# Altium project FMC_ADC_250M_16B_4ch.PrjPCB (part 4 of 4)

## Sheet Triggers.SchDoc
size A4
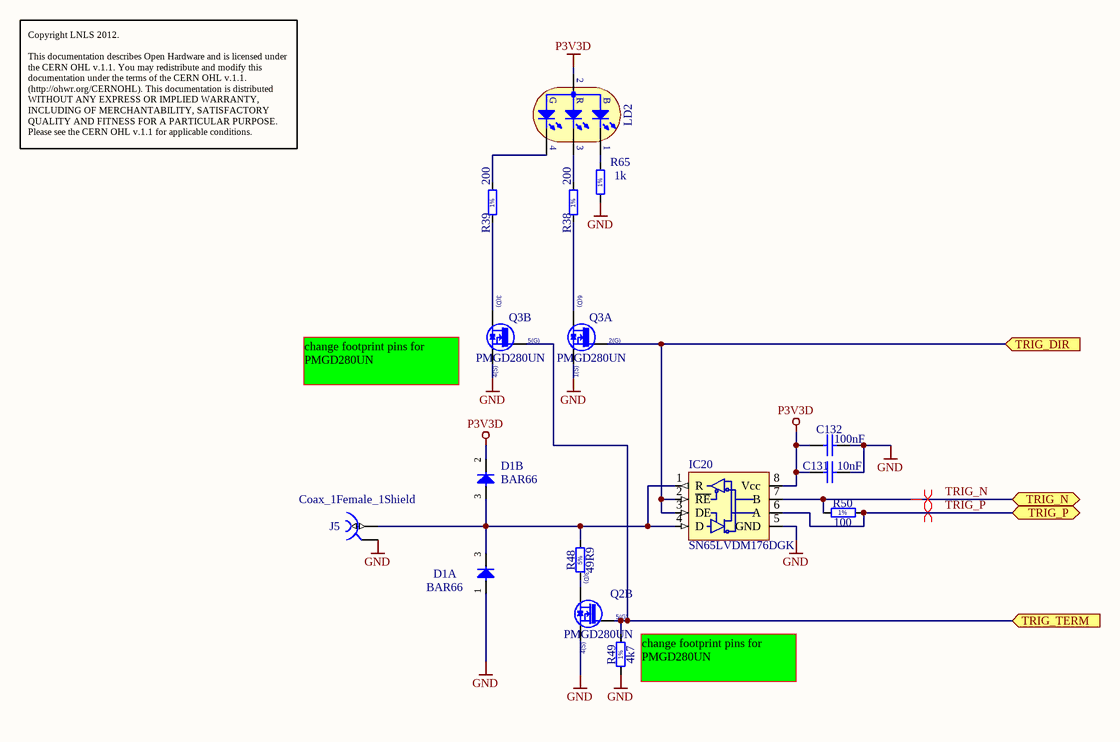
[diagram p7: Triggers.SchDoc]

### Parts
C131  10nF  [CAPC0603X33N]
C132  100nF  [CAPC0603X33N]
D1  BAR66  [SOT95P240X110-3I]  (parts A,B of 2)
IC20  SN65LVDM176DGK  [SOP65P490X110-8N]
J5  Coax_1Female_1Shield  [HUBER-SUHNER_85_MMCX-50-0-1/111 OH]
LD2  (no value)  [LED_AVAGO_HSMF-C113]
Q2  PMGD280UN  [SOT65P210X110-6N]  (part B of 2)
Q3  PMGD280UN  [SOT65P210X110-6N]  (parts A,B of 2)
R38  200  [RESC1005X40N]
R39  200  [RESC1005X40N]
R48  49R9  [RESC3225X70N]
R49  4k7  [RESC1005X40N]
R50  100  [RESC1005X40N]
R65  1k  [RESC1005X40N]

### Ports
TRIG_DIR (in), TRIG_N (bidir), TRIG_P (bidir), TRIG_TERM (in)

### Nets
GND: C131.2 C132.2 D1.1(A) IC20.5(GND) J5.2 Q2.4(S) Q3.1(S) Q3.4(S) R49.1 R65.1
P3V3D: C131.1 C132.1 D1.2(C) IC20.8(Vcc) LD2.2(AC)
TRIG_DIR: IC20.2(~{RE}) IC20.3(DE) Q3.2(G) ; port TRIG_DIR
TRIG_N: IC20.7(B) R50.1 ; port TRIG_N  [project net LA33_N]
TRIG_P: IC20.6(A) R50.2 ; port TRIG_P  [project net LA33_P]
TRIG_TERM: Q2.5(G) Q3.5(G) R49.2 ; port TRIG_TERM
NetD1_3: D1.3(COMAC) IC20.1(R) IC20.4(D) J5.1 R48.2
NetLD2_1: LD2.1(CB) R65.2
NetLD2_3: LD2.3(CR) R38.2
NetLD2_4: LD2.4(CG) R39.2
NetQ2_3: Q2.3(D) R48.1
NetQ3_3: Q3.3(D) R39.1
NetQ3_6: Q3.6(D) R38.1

### Layout directives
differential pair: LA33_N, LA33_P

### Notes on the sheet
- Copyright LNLS 2012.
  This documentation describes Open Hardware and is licensed under the CERN OHL v.1.1. You may redistribute and modify this documentation under the terms of the CERN OHL v.1.1. (http://ohwr.org/CERNOHL). This documentation is distributed WITHOUT ANY EXPRESS OR IMPLIED WARRANTY, INCLUDING OF MERCHANTABILITY, SATISFACTORY QUALITY AND FITNESS FOR A PARTICULAR PURPOSE. Please see the CERN OHL v.1.1 for applicable conditions.
- (near Q3) change footprint pins for PMGD280UN
- (near R49) change footprint pins for PMGD280UN
- (in symbol LED_AVAGO_HSMF-C113) G; R; B
- (in symbol PMGD280UN, part A) 6(D); 2(G); 1(S)
- (in symbol PMGD280UN, part B) 3(D); 5(G); 4(S)
- (in symbol R0402_1K_1%_0.0625W_100PPM) 1%
- (in symbol R0402_4K7_1%_0.0625W_100PPM) 1%
- (in symbol R0402_100R_1%_0.0625W_100PPM) 1%
- (in symbol R0402_200R_1%_0.0625W_100PPM) 1%
- (in symbol R1210_270R_5%_0.5W_200PPM) 5%

### Library data of the parts
C131 = CC0201_10NF_10V_10%_X5R: Non-polarised capacitor; Part Description: SMD Multilayer Chip Ceramic Capacitor; Manufacturer: GENERIC; Manufacturer1 Part Number: 0201ZD103KAT2A; Voltage: 10V; TC: X5R; Tolerance: ±10%; Table: Capacitors SMD; Part Number: CC0201_10NF_10V_10%_X5R; Component Kind: Standard; Component Type: Standard; Pin Count: 2; Value: 10nF; Status: Not Recommended; Manufacturer Part Number: CC0201_10NF_10V_10%_X5R; Case: 0201; Mounted: Yes; Socket: No; SMD: Yes; Manufacturer1 Example: AVX; Manufacturer1 ComponentHeight: 0.33mm; HelpURL: \\cern.ch\dfs\Applications\Altium\Datasheets\CC0201_X5R_AVX.pdf; Author: CERN DEM JLC; CreateDate: 03/12/2007; LatestRevisionDate: 03/12/2007; Sense: No
C132 = CC0201_100NF_6.3V_10%_X5R: Non-polarised capacitor; Part Description: SMD Multilayer Chip Ceramic Capacitor; Manufacturer: GENERIC; Manufacturer1 Part Number: 02016D104KAT2A; Voltage: 6.3V; TC: X5R; Tolerance: ±10%; Table: Capacitors SMD; Part Number: CC0201_100NF_6.3V_10%_X5R; Component Kind: Standard; Component Type: Standard; Pin Count: 2; Value: 100nF; Status: Not Recommended; Manufacturer Part Number: CC0201_100NF_6.3V_10%_X5R; Case: 0201; Mounted: Yes; Socket: No; SMD: Yes; Manufacturer1 Example: AVX; Manufacturer1 ComponentHeight: 0.33mm; HelpURL: \\cern.ch\dfs\Applications\Altium\Datasheets\CC0201_X5R_AVX.pdf; Author: CERN DEM JLC; CreateDate: 03/12/2007; LatestRevisionDate: 03/12/2007; Sense: No
D1 = Diode x2 A1C3_A3C2: Serial Diode; Part Description: Silicon PIN Diode Array (Series Connected); Manufacturer: INFINEON; Voltage: 150V; Power: 250mA; Table: Diodes; Part Number: BAR66; Component Kind: Standard; Component Type: Standard; Device: BAR66; Footprint: SOT95P240X110-3N; PackageDescription: SOT23 3-Leads, Pitch 0.95mm - Body 1.3x2.9mm, IPC Medium Density; Manufacturer Part Number: BAR66; Pin Count: 3; Mounted: Yes; Socket: No; SMD: Yes; ComponentHeight: 1.1mm; HelpURL: C:\TSR\Laurin\Projects\FMC\CERN DAC\Parts\Digital\BAR66.pdf; Author: CERN DEM JLC; CreateDate: 18/01/2010; LatestRevisionDate: 05/10/2010; Case: SOT23
IC20 = SN65LVDM176DGK: Differential Bus Transceiver; Part Description: High Speed Differential Transceiver LVDS/LVTTL; Manufacturer: TEXAS INSTRUMENTS; PressFit: No; Bonding: No; Part Number: SN65LVDM176DGK; Component Kind: Standard; Component Type: Standard; Device: SN65LVDM176DGK; PackageDescription: SOP, 0.65mm pitch; 8 pin, 3.00mm W X 3.00mm L X 1.10mm H body, IPC Medium Density; Manufacturer Part Number: SN65LVDM176DGK; Pin Count: 8; Case: SOP8; Mounted: Yes; Socket: No; SMD: Yes; Sense: No; ComponentHeight: 1.1mm; Author: LNLS DIG GBMB; CreateDate: 28/05/2016; LatestRevisionDate: 28/05/2016
J5 = HUBER-SUHNER_85_MMCX-50-0-1/111 OH: Part Description: MMCX 50 Ohms Right Angle PCB Jack; Manufacturer: HUBER+SUHNER; Table: Miscellaneous; Part Number: HUBER-SUHNER_85_MMCX-50-0-1/111 OH; Component Kind: Standard; Component Type: Standard; Pin Count: 2; Family: MMCX; Mounted: Yes; Socket: No; SMD: No; Status: None; Manufacturer Part Number: 85_MMCX-50-0-1/111 OH; ComponentHeight: 9.6mm; HelpURL: \\cern.ch\dfs\Applications\Altium\Datasheets\HUBER-SUHNER_85_MMCX-50-0-1-111 OH.pdf; Author: CERN DEM JLC; CreateDate: 2011-10-04; LatestRevisionDate: 2011-10-04
LD2 = LED_AVAGO_HSMF-C113: Tricolor LEDs 1 Cathode Blue, 2 Common Anode, 3 Cathode Red, 4 Cathode Green; Part Description: Right Angle Tricolor (Blue, Red, Green) Surface Mount ChipLED; Manufacturer: AVAGO TECHNOLOGIES; Color: Blue/Red/Green; Table: LEDs & Displays; Bonding: No; PressFit: No; Part Number: LED_AVAGO_HSMF-C113; Component Kind: Standard; Component Type: Standard; PackageDescription: Right Angle Tricolor Surface Mount ChipLED, Body 2.5x1mm; Manufacturer Part Number: HSMF-C113; Pin Count: 4; Mounted: Yes; Socket: No; SMD: Yes; ComponentHeight: 1mm; HelpURL: \\cern.ch\dfs\Applications\Altium\Datasheets\LED_AVAGO_HSMF-C113.pdf; Author: CERN DEM JLC; CreateDate: 29/09/2010; LatestRevisionDate: 29/09/2010; Sense: No
Q2 Q3 = PMGD280UN: Dual N-Channel micro TrenchMOS™ Ultra Low Level FET; Manufacturer: NXP SEMICONDUCTORS; Part Description: 20V 870mA Dual N-Channel micro TrenchMOS™ Ultra Low Level FET; Bonding: No; PressFit: No; Part Number: PMGD280UN; Author: CERN DEM JLC; Case: SOT363; ComponentHeight: 1.1mm; Component Type: Standard; CreateDate: 19/11/2014; Device: PMGD280UN; HelpURL: \\cern.ch\dfs\Applications\Altium\Datasheets\PMGD280UN.pdf; LatestRevisionDate: 19/11/2014; Manufacturer Part Number: PMGD280UN; Mounted: Yes; PackageDescription: SOT363, SC70-6, SOT, 0.65mm Pitch, 6 pin, 1.25mm W X 2.00mm L X 1.10mm H, IPC Medium Density; Pin Count: 6; Sense: No; SMD: Yes; Socket: No
R38 R39 = R0402_200R_1%_0.0625W_100PPM: Resistor - 1%; Part Description: General Purpose Thick Film Chip Resistor; Manufacturer: GENERIC; Manufacturer1 Part Number: 232270672001L; TC: ±100ppm/°C; Table: Resistors SMD; Part Number: R0402_200R_1%_0.0625W_100PPM; Component Kind: Standard; Component Type: Standard; Pin Count: 2; Value: 200; Status: Not recommended; Power: 0.0625W; Tolerance: ±1%; Manufacturer Part Number: R0402_200R_1%_0.0625W_100PPM; Case: 0402; Mounted: Yes; Socket: No; SMD: Yes; Manufacturer1 Example: YAGEO PHYCOMP; Manufacturer1 ComponentHeight: 0.4mm; HelpURL: \\cern.ch\dfs\Applications\Altium\Datasheets\R0402_Phycomp_RC0402.pdf; Author: CERN DEM JLC; CreateDate: 03/12/2007; LatestRevisionDate: 17/10/2012; Sense: No
R48 = R1210_270R_5%_0.5W_200PPM: Resistor - 5%; Part Number: R1210_49R9_1%_0.33W_100PPM; Part Description: General Purpose Thick Film Chip Resistor; Manufacturer: VISHAY; Manufacturer Part Number: CRCW121049R9FK; Power: 0.33W; TC: ±100ppm/°C; Table: Resistors SMD; Component Kind: Standard; Component Type: Standard; Pin Count: 2; Value: 49R9; Status: None; Tolerance: ±5%; Case: 1210; Mounted: Yes; Socket: No; SMD: Yes; ComponentHeight: 0.7mm; HelpURL: \\cern.ch\dfs\Applications\Altium\Datasheets\R1210_PANASONIC_ERJ.pdf; Author: CERN DEM JLC; CreateDate: 2011-10-26; LatestRevisionDate: 2011-10-26
R49 = R0402_4K7_1%_0.0625W_100PPM: Resistor - 1%; Part Description: General Purpose Thick Film Chip Resistor; Manufacturer: GENERIC; Manufacturer1 Part Number: 232270674702L; TC: ±100ppm/°C; Table: Resistors SMD; Part Number: R0402_4K7_1%_0.0625W_100PPM; Component Kind: Standard; Component Type: Standard; Pin Count: 2; Value: 4k7; Status: Not recommended; Power: 0.0625W; Tolerance: ±1%; Manufacturer Part Number: R0402_4K7_1%_0.0625W_100PPM; Case: 0402; Mounted: Yes; Socket: No; SMD: Yes; Manufacturer1 Example: YAGEO PHYCOMP; Manufacturer1 ComponentHeight: 0.4mm; HelpURL: \\cern.ch\dfs\Applications\Altium\Datasheets\R0402_Phycomp_RC0402.pdf; Author: CERN DEM JLC; CreateDate: 03/12/2007; LatestRevisionDate: 17/10/2012; Sense: No
R50 = R0402_100R_1%_0.0625W_100PPM: as R51-R53 on sheet Clock_Distribution; Part Number: R0402_100R_1%_0.0625W_100PPM; Component Kind: Standard; Component Type: Standard; Pin Count: 2; Value: 100; Status: Not recommended; Power: 0.0625W; Tolerance: ±1%; Manufacturer Part Number: R0402_100R_1%_0.0625W_100PPM; Case: 0402; Mounted: Yes; Socket: No; SMD: Yes; Manufacturer1 Example: YAGEO PHYCOMP; Manufacturer1 ComponentHeight: 0.4mm; HelpURL: \\cern.ch\dfs\Applications\Altium\Datasheets\R0402_Phycomp_RC0402.pdf; Author: CERN DEM JLC; CreateDate: 03/12/2007; LatestRevisionDate: 17/10/2012; Sense: No
R65 = R0402_1K_1%_0.0625W_100PPM: Resistor - 1%; Part Description: General Purpose Thick Film Chip Resistor; Manufacturer: GENERIC; Manufacturer1 Part Number: 232270671002L; TC: ±100ppm/°C; Table: Resistors SMD; Part Number: R0402_1K_1%_0.0625W_100PPM; Component Kind: Standard; Component Type: Standard; Pin Count: 2; Value: 1k; Status: Not recommended; Power: 0.0625W; Tolerance: ±1%; Manufacturer Part Number: R0402_1K_1%_0.0625W_100PPM; Case: 0402; Mounted: Yes; Socket: No; SMD: Yes; Manufacturer1 Example: YAGEO PHYCOMP; Manufacturer1 ComponentHeight: 0.4mm; HelpURL: \\cern.ch\dfs\Applications\Altium\Datasheets\R0402_Phycomp_RC0402.pdf; Author: CERN DEM JLC; CreateDate: 03/12/2007; LatestRevisionDate: 17/10/2012; Sense: No

## Nets that join several sheets
3P3VAUX: EEPROM_Temp_LEDs (C55.2 IC22.8), FMC_connector (J6.d32)
GND: FMC_ADC_top (21 pins), EEPROM_Temp_LEDs (14 pins), FMC_connector (162 pins), U_ADC (30 pins), Supply (59 pins), Clock_Distribution (59 pins), U_ADC (30 pins), U_ADC (30 pins), U_ADC (30 pins), ADC_Buffers (99 pins), Triggers (10 pins)
P1V8_AVDD1: U_ADC (L4A.1), Supply (6 pins), U_ADC (L4B.1)
P1V8_AVDD2: Supply (6 pins), U_ADC (L4C.1), U_ADC (L4D.1)
P1V8_OVDD: FMC_ADC_top (C25.1 C129.2 IC18.1 IC19.1), U_ADC (L5A.2), Supply (6 pins), U_ADC (L5B.2), U_ADC (L5C.2), U_ADC (L5D.2)
P3V3: FMC_connector (J6.c39 J6.d36 J6.d38 J6.d40), Supply (C36.1 L2.1 L6.1 L8.1)
P3V3_BUF: Supply (C76.1 C123.1 L2.2), ADC_Buffers (126 pins)
P3V3CLK: Supply (C127.2 IC17.1 IC17.3 IC17.20), Clock_Distribution (45 pins)
P3V3D: EEPROM_Temp_LEDs (7 pins), FMC_connector (R132.1), Supply (C77.1 L6.2), Triggers (5 pins)
P12V0: FMC_connector (J6.c35 J6.c37), Supply (6 pins)
VADJ: FMC_ADC_top (6 pins), FMC_connector (8 pins), Clock_Distribution (IC26.2)
ADC1_CLK_N: U_ADC (C19A.1), Clock_Distribution (IC2.34 R20.1)
ADC1_CLK_P: U_ADC (C8A.1), Clock_Distribution (IC2.35 R19.1)
ADC2_CLK_N: Clock_Distribution (IC2.28 R23.1), U_ADC (C19B.1)
ADC2_CLK_P: Clock_Distribution (IC2.29 R21.1), U_ADC (C8B.1)
ADC3_CLK_N: Clock_Distribution (IC2.53 R18.1), U_ADC (C19C.1)
ADC3_CLK_P: Clock_Distribution (IC2.54 R17.1), U_ADC (C8C.1)
ADC4_CLK_N: Clock_Distribution (IC2.57 R15.1), U_ADC (C19D.1)
ADC4_CLK_P: Clock_Distribution (IC2.58 R14.1), U_ADC (C8D.1)
ADC_BUF_CSB0: FMC_ADC_top (IC18.5), U_ADC (IC1A.67)
ADC_BUF_CSB1: FMC_ADC_top (IC18.6), U_ADC (IC1B.67)
ADC_BUF_CSB2: FMC_ADC_top (IC18.7), U_ADC (IC1C.67)
ADC_BUF_CSB3: FMC_ADC_top (IC18.8), U_ADC (IC1D.67)
ADC_BUF_DATA0.CLKOUT_N: FMC_connector (J6.f5), ADC_Buffers (IC5.31)
ADC_BUF_DATA0.CLKOUT_P: FMC_connector (J6.f4), ADC_Buffers (IC5.32)
ADC_BUF_DATA0.D0_N: FMC_connector (J6.e3), ADC_Buffers (IC6.26)
ADC_BUF_DATA0.D0_P: FMC_connector (J6.e2), ADC_Buffers (IC6.25)
ADC_BUF_DATA0.D2_N: FMC_connector (J6.f8), ADC_Buffers (IC6.29)
ADC_BUF_DATA0.D2_P: FMC_connector (J6.f7), ADC_Buffers (IC6.30)
ADC_BUF_DATA0.D4_N: FMC_connector (J6.e7), ADC_Buffers (IC6.27)
ADC_BUF_DATA0.D4_P: FMC_connector (J6.e6), ADC_Buffers (IC6.28)
ADC_BUF_DATA0.D6_N: FMC_connector (J6.e10), ADC_Buffers (IC6.32)
ADC_BUF_DATA0.D6_P: FMC_connector (J6.e9), ADC_Buffers (IC6.31)
ADC_BUF_DATA0.D8_N: FMC_connector (J6.j7), ADC_Buffers (IC5.29)
ADC_BUF_DATA0.D8_P: FMC_connector (J6.j6), ADC_Buffers (IC5.30)
ADC_BUF_DATA0.D10_N: FMC_connector (J6.k8), ADC_Buffers (IC5.27)
ADC_BUF_DATA0.D10_P: FMC_connector (J6.k7), ADC_Buffers (IC5.28)
ADC_BUF_DATA0.D12_N: FMC_connector (J6.j10), ADC_Buffers (IC5.25)
ADC_BUF_DATA0.D12_P: FMC_connector (J6.j9), ADC_Buffers (IC5.26)
ADC_BUF_DATA0.D14_N: FMC_connector (J6.k11), ADC_Buffers (IC7.26)
ADC_BUF_DATA0.D14_P: FMC_connector (J6.k10), ADC_Buffers (IC7.25)
ADC_BUF_DATA1.CLKOUT_N: FMC_connector (J6.d9), ADC_Buffers (IC8.29)
ADC_BUF_DATA1.CLKOUT_P: FMC_connector (J6.d8), ADC_Buffers (IC8.30)
ADC_BUF_DATA1.D0_N: FMC_connector (J6.h11), ADC_Buffers (IC7.28)
ADC_BUF_DATA1.D0_P: FMC_connector (J6.h10), ADC_Buffers (IC7.27)
ADC_BUF_DATA1.D2_N: FMC_connector (J6.g10), ADC_Buffers (IC7.30)
ADC_BUF_DATA1.D2_P: FMC_connector (J6.g9), ADC_Buffers (IC7.29)
ADC_BUF_DATA1.D4_N: FMC_connector (J6.g13), ADC_Buffers (IC7.32)
ADC_BUF_DATA1.D4_P: FMC_connector (J6.g12), ADC_Buffers (IC7.31)
ADC_BUF_DATA1.D6_N: FMC_connector (J6.h14), ADC_Buffers (IC8.31)
ADC_BUF_DATA1.D6_P: FMC_connector (J6.h13), ADC_Buffers (IC8.32)
ADC_BUF_DATA1.D8_N: FMC_connector (J6.g16), ADC_Buffers (IC8.27)
ADC_BUF_DATA1.D8_P: FMC_connector (J6.g15), ADC_Buffers (IC8.28)
ADC_BUF_DATA1.D10_N: FMC_connector (J6.d18), ADC_Buffers (IC8.25)
ADC_BUF_DATA1.D10_P: FMC_connector (J6.d17), ADC_Buffers (IC8.26)
ADC_BUF_DATA1.D12_N: FMC_connector (J6.h17), ADC_Buffers (IC9.26)
ADC_BUF_DATA1.D12_P: FMC_connector (J6.h16), ADC_Buffers (IC9.25)
ADC_BUF_DATA1.D14_N: FMC_connector (J6.g19), ADC_Buffers (IC9.28)
ADC_BUF_DATA1.D14_P: FMC_connector (J6.g18), ADC_Buffers (IC9.27)
ADC_BUF_DATA2.CLKOUT_N: FMC_connector (J6.c23), ADC_Buffers (IC12.27)
ADC_BUF_DATA2.CLKOUT_P: FMC_connector (J6.c22), ADC_Buffers (IC12.28)
ADC_BUF_DATA2.D0_N: FMC_connector (J6.d21), ADC_Buffers (IC9.30)
ADC_BUF_DATA2.D0_P: FMC_connector (J6.d20), ADC_Buffers (IC9.29)
ADC_BUF_DATA2.D2_N: FMC_connector (J6.g22), ADC_Buffers (IC9.32)
ADC_BUF_DATA2.D2_P: FMC_connector (J6.g21), ADC_Buffers (IC9.31)
ADC_BUF_DATA2.D4_N: FMC_connector (J6.d24), ADC_Buffers (IC12.31)
ADC_BUF_DATA2.D4_P: FMC_connector (J6.d23), ADC_Buffers (IC12.32)
ADC_BUF_DATA2.D6_N: FMC_connector (J6.h23), ADC_Buffers (IC12.29)
ADC_BUF_DATA2.D6_P: FMC_connector (J6.h22), ADC_Buffers (IC12.30)
ADC_BUF_DATA2.D8_N: FMC_connector (J6.g25), ADC_Buffers (IC12.25)
ADC_BUF_DATA2.D8_P: FMC_connector (J6.g24), ADC_Buffers (IC12.26)
ADC_BUF_DATA2.D10_N: FMC_connector (J6.h26), ADC_Buffers (IC10.26)
ADC_BUF_DATA2.D10_P: FMC_connector (J6.h25), ADC_Buffers (IC10.25)
ADC_BUF_DATA2.D12_N: FMC_connector (J6.g28), ADC_Buffers (IC10.30)
ADC_BUF_DATA2.D12_P: FMC_connector (J6.g27), ADC_Buffers (IC10.29)
ADC_BUF_DATA2.D14_N: FMC_connector (J6.d27), ADC_Buffers (IC10.28)
ADC_BUF_DATA2.D14_P: FMC_connector (J6.d26), ADC_Buffers (IC10.27)
ADC_BUF_DATA3.CLKOUT_N: FMC_connector (J6.k29), ADC_Buffers (IC13.25)
ADC_BUF_DATA3.CLKOUT_P: FMC_connector (J6.k28), ADC_Buffers (IC13.26)
ADC_BUF_DATA3.D0_N: FMC_connector (J6.k26), ADC_Buffers (IC10.32)
ADC_BUF_DATA3.D0_P: FMC_connector (J6.k25), ADC_Buffers (IC10.31)
ADC_BUF_DATA3.D2_N: FMC_connector (J6.j31), ADC_Buffers (IC13.31)
ADC_BUF_DATA3.D2_P: FMC_connector (J6.j30), ADC_Buffers (IC13.32)
ADC_BUF_DATA3.D4_N: FMC_connector (J6.f32), ADC_Buffers (IC13.29)
ADC_BUF_DATA3.D4_P: FMC_connector (J6.f31), ADC_Buffers (IC13.30)
ADC_BUF_DATA3.D6_N: FMC_connector (J6.k32), ADC_Buffers (IC13.27)
ADC_BUF_DATA3.D6_P: FMC_connector (J6.k31), ADC_Buffers (IC13.28)
ADC_BUF_DATA3.D8_N: FMC_connector (J6.j34), ADC_Buffers (IC11.26)
ADC_BUF_DATA3.D8_P: FMC_connector (J6.j33), ADC_Buffers (IC11.25)
ADC_BUF_DATA3.D10_N: FMC_connector (J6.k35), ADC_Buffers (IC11.28)
ADC_BUF_DATA3.D10_P: FMC_connector (J6.k34), ADC_Buffers (IC11.27)
ADC_BUF_DATA3.D12_N: FMC_connector (J6.j37), ADC_Buffers (IC11.30)
ADC_BUF_DATA3.D12_P: FMC_connector (J6.j36), ADC_Buffers (IC11.29)
ADC_BUF_DATA3.D14_N: FMC_connector (J6.k38), ADC_Buffers (IC11.32)
ADC_BUF_DATA3.D14_P: FMC_connector (J6.k37), ADC_Buffers (IC11.31)
ADC_BUF_RESETn: FMC_ADC_top (IC18.10), U_ADC (IC1A.18), U_ADC (IC1B.18), U_ADC (IC1C.18), U_ADC (IC1D.18)
ADC_BUF_SCLK: FMC_ADC_top (IC18.4), U_ADC (IC1A.68), U_ADC (IC1B.68), U_ADC (IC1C.68), U_ADC (IC1D.68)
ADC_BUF_SDI: FMC_ADC_top (IC18.3), U_ADC (IC1A.69), U_ADC (IC1B.69), U_ADC (IC1C.69), U_ADC (IC1D.69)
ADC_BUF_SDO: FMC_ADC_top (IC19.3), U_ADC (IC1A.66), U_ADC (IC1B.66), U_ADC (IC1C.66), U_ADC (IC1D.66)
ADC_BUF_SLEEP: FMC_ADC_top (IC18.9), U_ADC (IC1A.3), U_ADC (IC1B.3), U_ADC (IC1C.3), U_ADC (IC1D.3)
ADC_CSB0: FMC_ADC_top (IC18.19), FMC_connector (J6.c15)
ADC_CSB1: FMC_ADC_top (IC18.18), FMC_connector (J6.d15)
ADC_CSB2: FMC_ADC_top (IC18.17), FMC_connector (J6.c14)
ADC_CSB3: FMC_ADC_top (IC18.16), FMC_connector (J6.d14)
ADC_DATA0.CLKOUT_N: U_ADC (IC1A.47), ADC_Buffers (IC5.10)
ADC_DATA0.CLKOUT_P: U_ADC (IC1A.48), ADC_Buffers (IC5.9)
ADC_DATA0.D0_N: U_ADC (IC1A.63), ADC_Buffers (IC6.15)
ADC_DATA0.D0_P: U_ADC (IC1A.64), ADC_Buffers (IC6.16)
ADC_DATA0.D2_N: U_ADC (IC1A.59), ADC_Buffers (IC6.12)
ADC_DATA0.D2_P: U_ADC (IC1A.60), ADC_Buffers (IC6.11)
ADC_DATA0.D4_N: U_ADC (IC1A.55), ADC_Buffers (IC6.14)
ADC_DATA0.D4_P: U_ADC (IC1A.56), ADC_Buffers (IC6.13)
ADC_DATA0.D6_N: U_ADC (IC1A.51), ADC_Buffers (IC6.9)
ADC_DATA0.D6_P: U_ADC (IC1A.52), ADC_Buffers (IC6.10)
ADC_DATA0.D8_N: U_ADC (IC1A.43), ADC_Buffers (IC5.12)
ADC_DATA0.D8_P: U_ADC (IC1A.44), ADC_Buffers (IC5.11)
ADC_DATA0.D10_N: U_ADC (IC1A.39), ADC_Buffers (IC5.14)
ADC_DATA0.D10_P: U_ADC (IC1A.40), ADC_Buffers (IC5.13)
ADC_DATA0.D12_N: U_ADC (IC1A.35), ADC_Buffers (IC5.16)
ADC_DATA0.D12_P: U_ADC (IC1A.36), ADC_Buffers (IC5.15)
ADC_DATA0.D14_N: U_ADC (IC1A.30), ADC_Buffers (IC7.15)
ADC_DATA0.D14_P: U_ADC (IC1A.31), ADC_Buffers (IC7.16)
ADC_DATA1.CLKOUT_N: U_ADC (IC1B.47), ADC_Buffers (IC8.12)
ADC_DATA1.CLKOUT_P: U_ADC (IC1B.48), ADC_Buffers (IC8.11)
ADC_DATA1.D0_N: U_ADC (IC1B.63), ADC_Buffers (IC7.13)
ADC_DATA1.D0_P: U_ADC (IC1B.64), ADC_Buffers (IC7.14)
ADC_DATA1.D2_N: U_ADC (IC1B.59), ADC_Buffers (IC7.11)
ADC_DATA1.D2_P: U_ADC (IC1B.60), ADC_Buffers (IC7.12)
ADC_DATA1.D4_N: U_ADC (IC1B.55), ADC_Buffers (IC7.9)
ADC_DATA1.D4_P: U_ADC (IC1B.56), ADC_Buffers (IC7.10)
ADC_DATA1.D6_N: U_ADC (IC1B.51), ADC_Buffers (IC8.10)
ADC_DATA1.D6_P: U_ADC (IC1B.52), ADC_Buffers (IC8.9)
ADC_DATA1.D8_N: U_ADC (IC1B.43), ADC_Buffers (IC8.14)
ADC_DATA1.D8_P: U_ADC (IC1B.44), ADC_Buffers (IC8.13)
ADC_DATA1.D10_N: U_ADC (IC1B.39), ADC_Buffers (IC8.16)
ADC_DATA1.D10_P: U_ADC (IC1B.40), ADC_Buffers (IC8.15)
ADC_DATA1.D12_N: U_ADC (IC1B.35), ADC_Buffers (IC9.15)
ADC_DATA1.D12_P: U_ADC (IC1B.36), ADC_Buffers (IC9.16)
ADC_DATA1.D14_N: U_ADC (IC1B.30), ADC_Buffers (IC9.13)
ADC_DATA1.D14_P: U_ADC (IC1B.31), ADC_Buffers (IC9.14)
ADC_DATA2.CLKOUT_N: U_ADC (IC1C.47), ADC_Buffers (IC12.14)
ADC_DATA2.CLKOUT_P: U_ADC (IC1C.48), ADC_Buffers (IC12.13)
ADC_DATA2.D0_N: U_ADC (IC1C.63), ADC_Buffers (IC9.11)
ADC_DATA2.D0_P: U_ADC (IC1C.64), ADC_Buffers (IC9.12)
ADC_DATA2.D2_N: U_ADC (IC1C.59), ADC_Buffers (IC9.9)
ADC_DATA2.D2_P: U_ADC (IC1C.60), ADC_Buffers (IC9.10)
ADC_DATA2.D4_N: U_ADC (IC1C.55), ADC_Buffers (IC12.10)
ADC_DATA2.D4_P: U_ADC (IC1C.56), ADC_Buffers (IC12.9)
ADC_DATA2.D6_N: U_ADC (IC1C.51), ADC_Buffers (IC12.12)
ADC_DATA2.D6_P: U_ADC (IC1C.52), ADC_Buffers (IC12.11)
ADC_DATA2.D8_N: U_ADC (IC1C.43), ADC_Buffers (IC12.16)
ADC_DATA2.D8_P: U_ADC (IC1C.44), ADC_Buffers (IC12.15)
ADC_DATA2.D10_N: U_ADC (IC1C.39), ADC_Buffers (IC10.15)
ADC_DATA2.D10_P: U_ADC (IC1C.40), ADC_Buffers (IC10.16)
ADC_DATA2.D12_N: U_ADC (IC1C.35), ADC_Buffers (IC10.11)
ADC_DATA2.D12_P: U_ADC (IC1C.36), ADC_Buffers (IC10.12)
ADC_DATA2.D14_N: U_ADC (IC1C.30), ADC_Buffers (IC10.13)
ADC_DATA2.D14_P: U_ADC (IC1C.31), ADC_Buffers (IC10.14)
ADC_DATA3.CLKOUT_N: U_ADC (IC1D.47), ADC_Buffers (IC13.16)
ADC_DATA3.CLKOUT_P: U_ADC (IC1D.48), ADC_Buffers (IC13.15)
ADC_DATA3.D0_N: U_ADC (IC1D.63), ADC_Buffers (IC10.9)
ADC_DATA3.D0_P: U_ADC (IC1D.64), ADC_Buffers (IC10.10)
ADC_DATA3.D2_N: U_ADC (IC1D.59), ADC_Buffers (IC13.10)
ADC_DATA3.D2_P: U_ADC (IC1D.60), ADC_Buffers (IC13.9)
ADC_DATA3.D4_N: U_ADC (IC1D.55), ADC_Buffers (IC13.12)
ADC_DATA3.D4_P: U_ADC (IC1D.56), ADC_Buffers (IC13.11)
ADC_DATA3.D6_N: U_ADC (IC1D.51), ADC_Buffers (IC13.14)
ADC_DATA3.D6_P: U_ADC (IC1D.52), ADC_Buffers (IC13.13)
ADC_DATA3.D8_N: U_ADC (IC1D.43), ADC_Buffers (IC11.15)
ADC_DATA3.D8_P: U_ADC (IC1D.44), ADC_Buffers (IC11.16)
ADC_DATA3.D10_N: U_ADC (IC1D.39), ADC_Buffers (IC11.13)
ADC_DATA3.D10_P: U_ADC (IC1D.40), ADC_Buffers (IC11.14)
ADC_DATA3.D12_N: U_ADC (IC1D.35), ADC_Buffers (IC11.11)
ADC_DATA3.D12_P: U_ADC (IC1D.36), ADC_Buffers (IC11.12)
ADC_DATA3.D14_N: U_ADC (IC1D.30), ADC_Buffers (IC11.9)
ADC_DATA3.D14_P: U_ADC (IC1D.31), ADC_Buffers (IC11.10)
ADC_RESETn: FMC_ADC_top (IC18.14), FMC_connector (J6.e12)
ADC_SCLK: FMC_ADC_top (IC18.20), FMC_connector (J6.c18)
ADC_SDI: FMC_ADC_top (IC18.21), FMC_connector (J6.c19)
ADC_SDO: FMC_ADC_top (IC19.4), FMC_connector (J6.d12)
ADC_SLEEP: FMC_ADC_top (IC18.15), FMC_connector (J6.f14)
CLK_SEL: FMC_connector (J6.j22), Clock_Distribution (IC4.6 R44.1)
CLKDIVRST_N: FMC_ADC_top (R3.1), FMC_connector (J6.h38), U_ADC (IC1A.25), U_ADC (IC1B.25), U_ADC (IC1C.25), U_ADC (IC1D.25)
CLKDIVRST_P: FMC_ADC_top (R3.2), FMC_connector (J6.h37), U_ADC (IC1A.24), U_ADC (IC1B.24), U_ADC (IC1C.24), U_ADC (IC1D.24)
FMC_CLK_N: FMC_connector (J6.k5), Clock_Distribution (IC4.4 R45.2)
FMC_CLK_P: FMC_connector (J6.k4), Clock_Distribution (IC4.3 R45.1)
FPGA_CLK_N: FMC_connector (J6.h5), Clock_Distribution (IC2.24)
FPGA_CLK_P: FMC_connector (J6.h4), Clock_Distribution (IC2.25)
GA0: EEPROM_Temp_LEDs (IC22.2), FMC_connector (J6.c34)
GA1: EEPROM_Temp_LEDs (IC22.1), FMC_connector (J6.d35)
IN1: FMC_ADC_top (J1.1), U_ADC (C7A.2)
IN2: FMC_ADC_top (J2.1), U_ADC (C7B.2)
IN3: FMC_ADC_top (J8.1), U_ADC (C7C.2)
IN4: FMC_ADC_top (J9.1), U_ADC (C7D.2)
IPTAT1: EEPROM_Temp_LEDs (R32.2), U_ADC (IC1A.16)
IPTAT2: EEPROM_Temp_LEDs (R33.2), U_ADC (IC1B.16)
IPTAT3: EEPROM_Temp_LEDs (R34.2), U_ADC (IC1C.16)
IPTAT4: EEPROM_Temp_LEDs (R35.2), U_ADC (IC1D.16)
LA24_N: EEPROM_Temp_LEDs (Q1.5), FMC_connector (J6.h29)
LA24_P: EEPROM_Temp_LEDs (Q2.2), FMC_connector (J6.h28)
LA28_N: EEPROM_Temp_LEDs (IC15.2), FMC_connector (J6.h32)
LA29_P: EEPROM_Temp_LEDs (Q1.2), FMC_connector (J6.g30)
LA30_N: EEPROM_Temp_LEDs (IC15.35), FMC_connector (J6.h35)
LA30_P: EEPROM_Temp_LEDs (R46.1), FMC_connector (J6.h34)
LA31_N: EEPROM_Temp_LEDs (IC15.33), FMC_connector (J6.g34)
LA31_P: EEPROM_Temp_LEDs (IC15.32), FMC_connector (J6.g33)
LA33_N: FMC_connector (J6.g37), Triggers (IC20.7 R50.1)
LA33_P: FMC_connector (J6.g36), Triggers (IC20.6 R50.2)
NetC55A_1: FMC_ADC_top (J1.2), U_ADC (C55A.1 C56A.2)
NetC55B_1: FMC_ADC_top (J2.2), U_ADC (C55B.1 C56B.2)
NetC55C_1: FMC_ADC_top (J8.2), U_ADC (C55C.1 C56C.2)
NetC55D_1: FMC_ADC_top (J9.2), U_ADC (C55D.1 C56D.2)
PLL_FUNCTION: FMC_connector (J6.j19), Clock_Distribution (IC2.16)
PLL_SCB: FMC_connector (J6.k19), Clock_Distribution (IC2.21)
PLL_SCLK: FMC_connector (J6.j21), Clock_Distribution (IC2.18)
PLL_SDIO: FMC_connector (D4.2 J6.k20), Clock_Distribution (R51.1)
PLL_SDO: FMC_connector (D6.2 J6.k22), Clock_Distribution (R52.1)
PLL_STATUS: FMC_connector (D5.2 J6.j18), Clock_Distribution (R53.1)
SCL: EEPROM_Temp_LEDs (IC22.6), FMC_connector (J6.c30)
SDA: EEPROM_Temp_LEDs (IC22.5), FMC_connector (J6.c31)
Si_OE: FMC_connector (R75.2), Clock_Distribution (OSC2.2)
Si_SCL: FMC_connector (J6.c10), Clock_Distribution (IC26.3)
Si_SDA: FMC_connector (J6.c11), Clock_Distribution (IC26.4)
TRIG_DIR: FMC_connector (J6.c26), Triggers (IC20.2 IC20.3 Q3.2)
TRIG_TERM: FMC_connector (J6.c27), Triggers (Q2.5 Q3.5 R49.2)

## Assembly variants
active clock: not fitted C60 R22 R24 R41 R56 R57 R58 R59 R60 R61
passive clock: not fitted L1 L3 L9 R26 R62 R63 R66 R67 R68 R69 R70 R71 R72 R73; alternate parts R24 -> 0R
active clock_GSI: not fitted C60 IC3 J7 J10 OSC1 R22 R24 R41 R56 R57 R58 R59 R60 R61 TR2 TR3 TR4 TR5